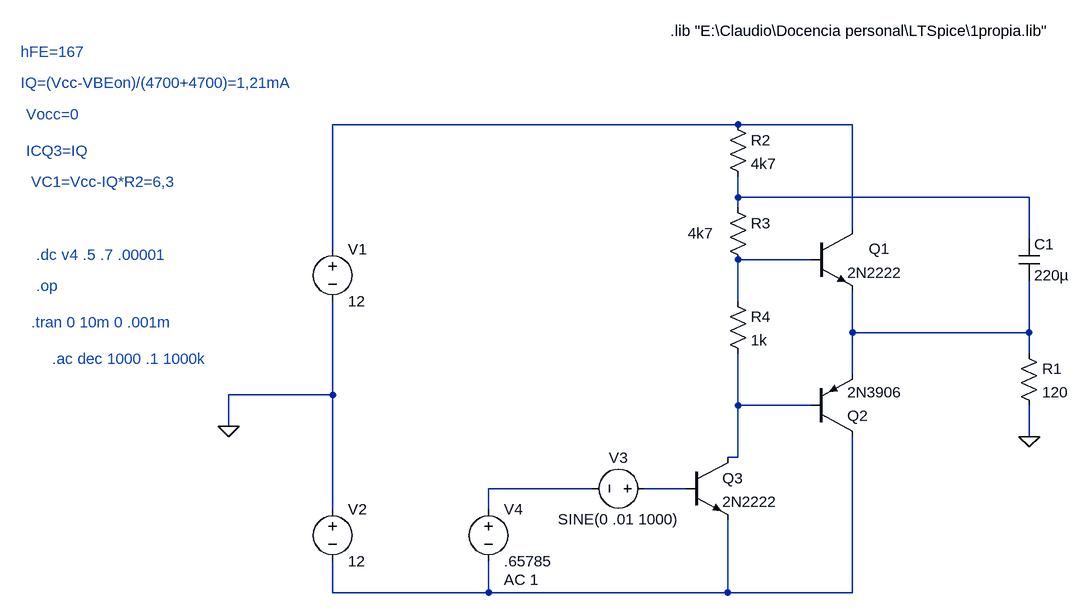
[diagram p0: schematic clase ab respuesta en frecuencia a.asc]
clase ab respuesta en frecuencia a.asc, the LTspice schematic file:
Version 4
SHEET 1 1392 984
WIRE 112 160 -512 160
WIRE 288 160 112 160
WIRE 112 272 112 240
WIRE 560 272 112 272
WIRE 112 288 112 272
WIRE 288 320 288 160
WIRE 560 336 560 272
WIRE -512 352 -512 160
WIRE 224 368 112 368
WIRE 112 432 112 368
WIRE 288 480 288 416
WIRE 560 480 560 400
WIRE 560 480 288 480
WIRE 560 512 560 480
WIRE 288 544 288 480
WIRE -512 576 -512 432
WIRE -512 576 -672 576
WIRE 112 592 112 512
WIRE 224 592 112 592
WIRE -672 624 -672 576
WIRE 560 640 560 592
WIRE 112 672 112 592
WIRE 112 672 96 672
WIRE -112 720 -272 720
WIRE 32 720 -32 720
WIRE -512 752 -512 576
WIRE -272 752 -272 720
WIRE -512 880 -512 832
WIRE -272 880 -272 832
WIRE -272 880 -512 880
WIRE 96 880 96 768
WIRE 96 880 -272 880
WIRE 288 880 288 640
WIRE 288 880 96 880
FLAG -672 624 0
FLAG 560 640 0
DATAFLAG 560 480 ""
DATAFLAG 112 272 ""
DATAFLAG 112 272 ""
DATAFLAG 160 368 ""
DATAFLAG 208 592 ""
SYMBOL npn 224 320 R0
WINDOW 0 89 31 Left 2
SYMATTR InstName Q1
SYMATTR Value 2N2222
SYMBOL pnp 224 640 M180
SYMATTR InstName Q2
SYMATTR Value 2N3906
SYMBOL voltage -512 336 R0
WINDOW 123 0 0 Left 0
WINDOW 39 0 0 Left 0
SYMATTR InstName V1
SYMATTR Value 12
SYMBOL voltage -512 736 R0
WINDOW 123 0 0 Left 0
WINDOW 39 0 0 Left 0
SYMATTR InstName V2
SYMATTR Value 12
SYMBOL res 544 496 R0
SYMATTR InstName R1
SYMATTR Value 120
SYMBOL res 96 144 R0
SYMATTR InstName R2
SYMATTR Value 4k7
SYMBOL cap 544 336 R0
SYMATTR InstName C1
SYMATTR Value 220µ
SYMBOL npn 32 672 R0
SYMATTR InstName Q3
SYMATTR Value 2N2222
SYMBOL voltage -16 720 R90
WINDOW 0 -32 56 VBottom 2
WINDOW 3 32 56 VTop 2
WINDOW 123 0 0 Left 0
WINDOW 39 0 0 Left 0
SYMATTR InstName V3
SYMATTR Value SINE(0 .01 1000)
SYMBOL voltage -272 736 R0
WINDOW 123 24 124 Left 2
WINDOW 39 0 0 Left 0
SYMATTR Value2 AC 1
SYMATTR InstName V4
SYMATTR Value .65785
SYMBOL res 96 416 R0
SYMATTR InstName R4
SYMATTR Value 1k
SYMBOL res 96 272 R0
WINDOW 3 -61 55 Left 2
SYMATTR InstName R3
SYMATTR Value 4k7
TEXT 8 16 Left 2 !.lib "E:\\Claudio\\Docencia personal\\LTSpice\\1propia.lib"
TEXT -992 48 Left 2 ;hFE=167
TEXT -992 96 Left 2 ;IQ=(Vcc-VBEon)/(4700+4700)=1,21mA
TEXT -984 144 Left 2 ;Vocc=0
TEXT -984 200 Left 2 ;ICQ3=IQ
TEXT -976 248 Left 2 ;VC1=Vcc-IQ*R2=6,3
TEXT -976 464 Left 2 ;.tran 0 10m 0 .001m
TEXT -968 408 Left 2 ;.op
TEXT -968 360 Left 2 ;.dc v4 .5 .7 .00001
TEXT -944 520 Left 2 ;.ac dec 1000 .1 1000k

The netlist it stands for:
* clase ab respuesta en frecuencia a.asc
Q1 N001 N003 N004 0 2N2222
Q2 N008 N005 N004 0 2N3906
V1 N001 0 12
V2 0 N008 12
R1 N004 0 120
R2 N001 N002 4k7
C1 N002 N004 220µ
Q3 N005 N007 N008 0 2N2222
V3 N007 N006 SINE(0 .01 1000)
V4 N006 N008 .65785 AC 1
R4 N003 N005 1k
R3 N002 N003 4k7
.model NPN NPN
.model PNP PNP
.lib standard.bjt
.lib "E:\Claudio\Docencia personal\LTSpice\1propia.lib"
* hFE=167
* IQ=(Vcc-VBEon)/(4700+4700)=1,21mA
* Vocc=0
* ICQ3=IQ
* VC1=Vcc-IQ*R2=6,3
* .tran 0 10m 0 .001m
* .op
* .dc v4 .5 .7 .00001
* .ac dec 1000 .1 1000k
.backanno
.end